# EAGLE design cmgresonator-en93-26 (EAGLE 6.6.0)
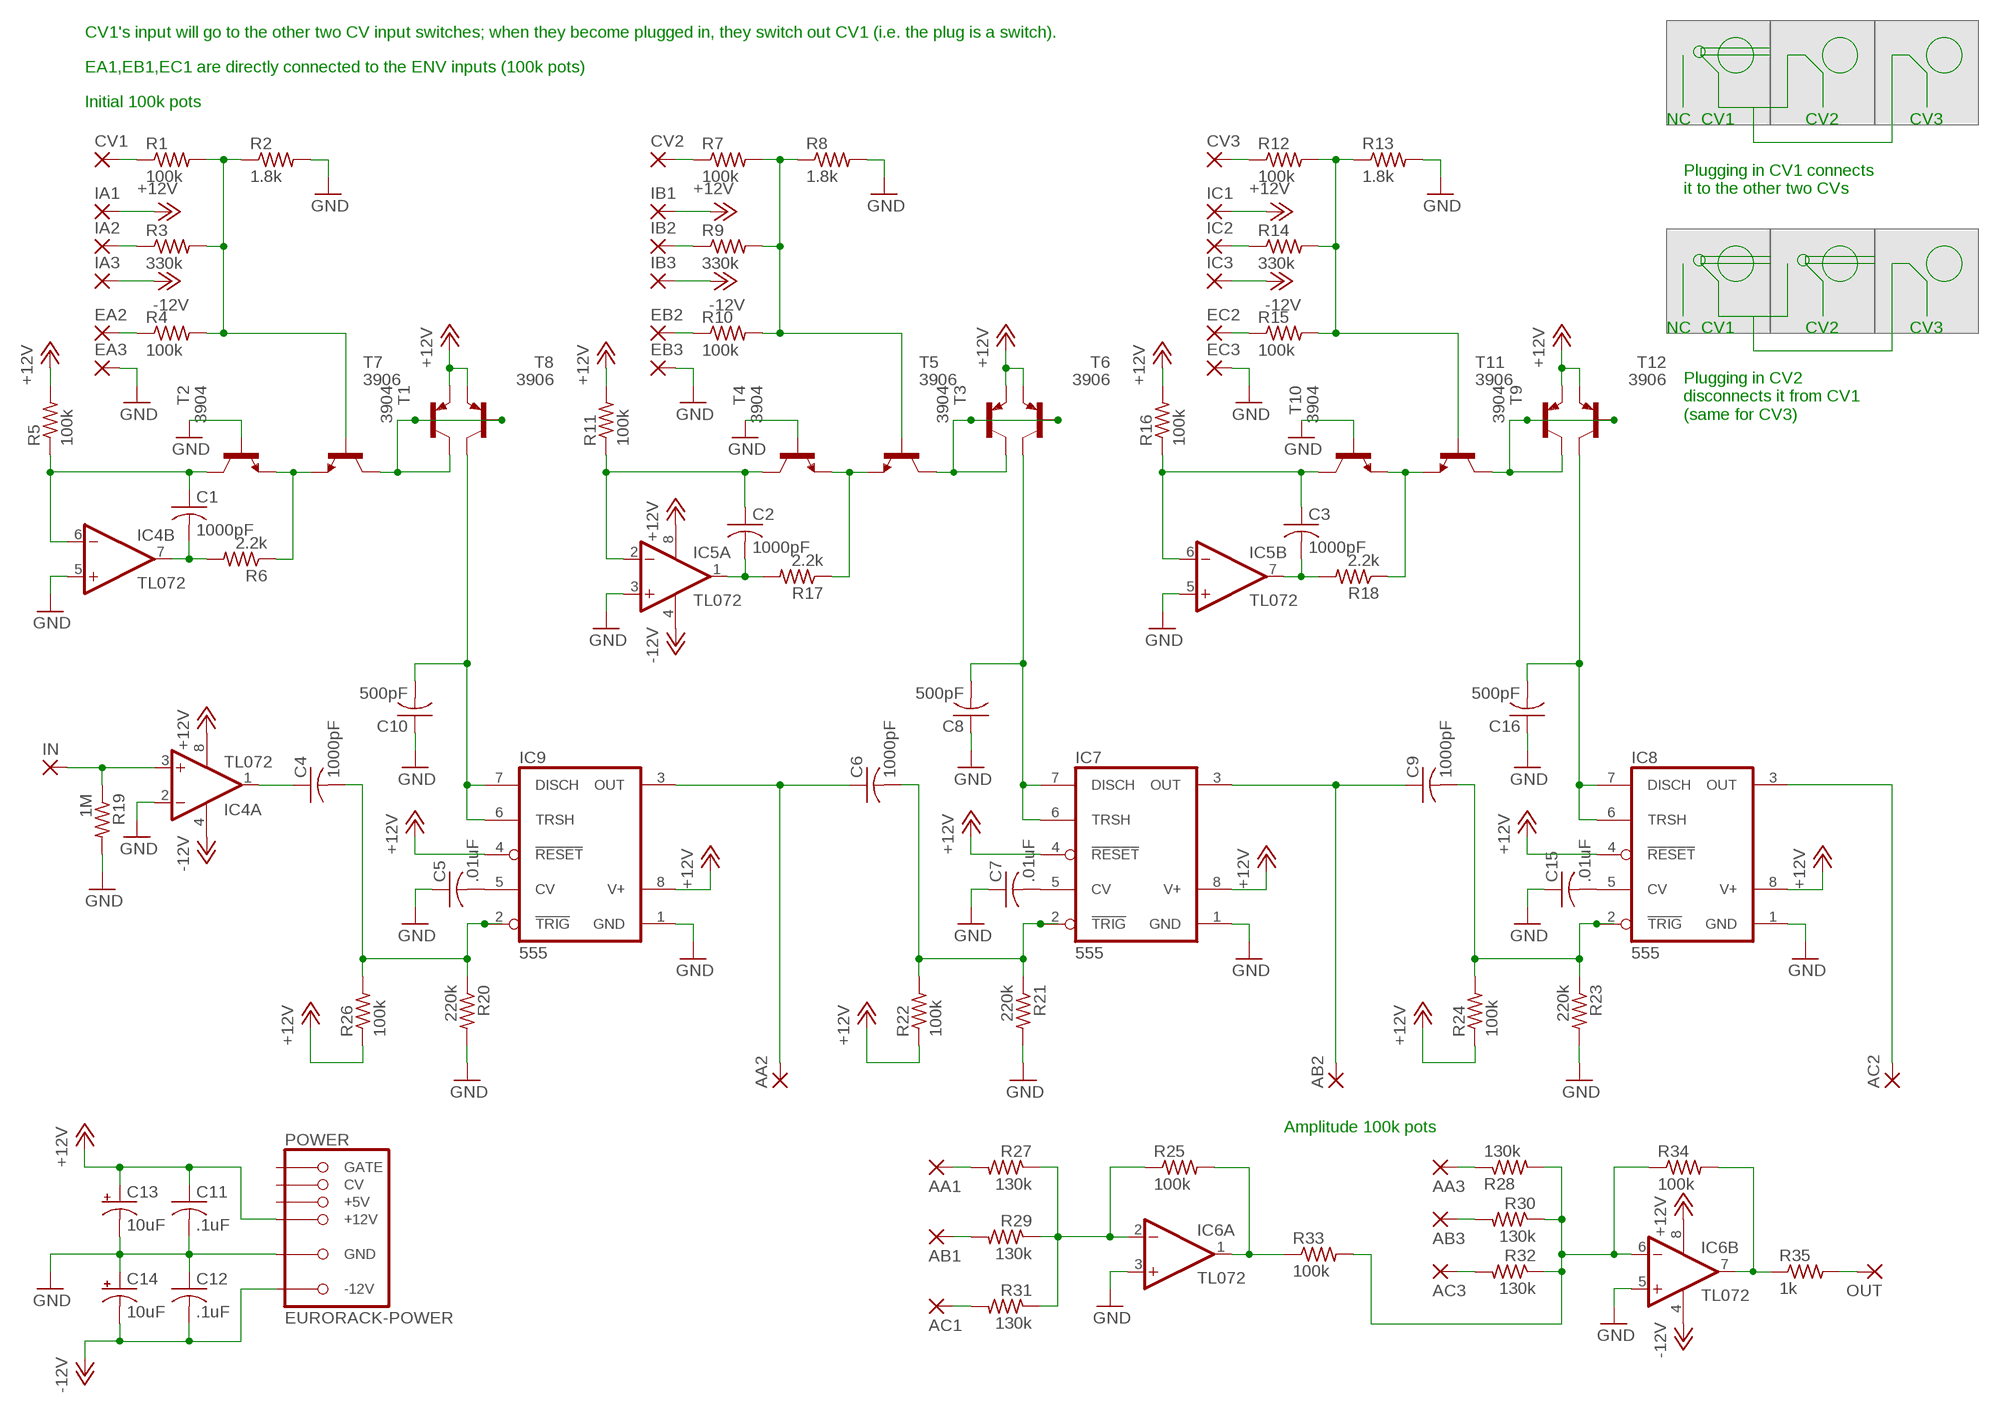
[diagram p0: schematic, sheet 1]

## Parts
AA1  2,54/1,0  [2,54/1,0]
AA2  2,54/1,0  [2,54/1,0]
AA3  2,54/1,0  [2,54/1,0]
AB1  2,54/1,0  [2,54/1,0]
AB2  2,54/1,0  [2,54/1,0]
AB3  2,54/1,0  [2,54/1,0]
AC1  2,54/1,0  [2,54/1,0]
AC2  2,54/1,0  [2,54/1,0]
AC3  2,54/1,0  [2,54/1,0]
C1  1000pF  C-US050-025X075  [C050-025X075]
C2  1000pF  C-US050-025X075  [C050-025X075]
C3  1000pF  C-US050-025X075  [C050-025X075]
C4  1000pF  C-US050-025X075  [C050-025X075]
C5  .01uF  C-US050-025X075  [C050-025X075]
C6  1000pF  C-US050-025X075  [C050-025X075]
C7  .01uF  C-US050-025X075  [C050-025X075]
C8  500pF  C-US050-025X075  [C050-025X075]
C9  1000pF  C-US050-025X075  [C050-025X075]
C10  500pF  C-US050-025X075  [C050-025X075]
C11  .1uF  C-US050-025X075  [C050-025X075]
C12  .1uF  C-US050-025X075  [C050-025X075]
C13  10uF  CPOL-USE2.5-5  [E2,5-5]
C14  10uF  CPOL-USE2.5-5  [E2,5-5]
C15  .01uF  C-US050-025X075  [C050-025X075]
C16  500pF  C-US050-025X075  [C050-025X075]
CV1  2,54/1,0  [2,54/1,0]
CV2  2,54/1,0  [2,54/1,0]
CV3  2,54/1,0  [2,54/1,0]
EA2  2,54/1,0  [2,54/1,0]
EA3  2,54/1,0  [2,54/1,0]
EB2  2,54/1,0  [2,54/1,0]
EB3  2,54/1,0  [2,54/1,0]
EC2  2,54/1,0  [2,54/1,0]
EC3  2,54/1,0  [2,54/1,0]
IA1  2,54/1,0  [2,54/1,0]
IA2  2,54/1,0  [2,54/1,0]
IA3  2,54/1,0  [2,54/1,0]
IB1  2,54/1,0  [2,54/1,0]
IB2  2,54/1,0  [2,54/1,0]
IB3  2,54/1,0  [2,54/1,0]
IC1  2,54/1,0  [2,54/1,0]
IC2  2,54/1,0  [2,54/1,0]
IC3  2,54/1,0  [2,54/1,0]
IC4  TL072  TL072-TOPP  [DIL08]
IC5  TL072  TL072-TOPP  [DIL08]
IC6  TL072  TL072-TOPP  [DIL08]
IC7  555  ICM7555  [DIL08]
IC8  555  ICM7555  [DIL08]
IC9  555  ICM7555  [DIL08]
IN  2,54/1,0  [2,54/1,0]
OUT  2,54/1,0  [2,54/1,0]
POWER  EURORACK-POWER  [PINSHRD_PTH_2X8]
R1  100k  R-US_0207/10  [0207/10]
R2  1.8k  R-US_0207/10  [0207/10]
R3  330k  R-US_0207/10  [0207/10]
R4  100k  R-US_0207/10  [0207/10]
R5  100k  R-US_0207/10  [0207/10]
R6  2.2k  R-US_0207/10  [0207/10]
R7  100k  R-US_0207/10  [0207/10]
R8  1.8k  R-US_0207/10  [0207/10]
R9  330k  R-US_0207/10  [0207/10]
R10  100k  R-US_0207/10  [0207/10]
R11  100k  R-US_0207/10  [0207/10]
R12  100k  R-US_0207/10  [0207/10]
R13  1.8k  R-US_0207/10  [0207/10]
R14  330k  R-US_0207/10  [0207/10]
R15  100k  R-US_0207/10  [0207/10]
R16  100k  R-US_0207/10  [0207/10]
R17  2.2k  R-US_0207/10  [0207/10]
R18  2.2k  R-US_0207/10  [0207/10]
R19  1M  R-US_0207/10  [0207/10]
R20  220k  R-US_0207/10  [0207/10]
R21  220k  R-US_0207/10  [0207/10]
R22  100k  R-US_0207/10  [0207/10]
R23  220k  R-US_0207/10  [0207/10]
R24  100k  R-US_0207/10  [0207/10]
R25  100k  R-US_0207/10  [0207/10]
R26  100k  R-US_0207/10  [0207/10]
R27  130k  R-US_0207/10  [0207/10]
R28  130k  R-US_0207/10  [0207/10]
R29  130k  R-US_0207/10  [0207/10]
R30  130k  R-US_0207/10  [0207/10]
R31  130k  R-US_0207/10  [0207/10]
R32  130k  R-US_0207/10  [0207/10]
R33  100k  R-US_0207/10  [0207/10]
R34  100k  R-US_0207/10  [0207/10]
R35  1k  R-US_0207/10  [0207/10]
T1  3904  2N3904-NPN-TO92-EBC  [TO92-EBC]
T2  3904  2N3904-NPN-TO92-EBC  [TO92-EBC]
T3  3904  2N3904-NPN-TO92-EBC  [TO92-EBC]
T4  3904  2N3904-NPN-TO92-EBC  [TO92-EBC]
T5  3906  2N3906-PNP-TO92-EBC  [TO92-EBC]
T6  3906  2N3906-PNP-TO92-EBC  [TO92-EBC]
T7  3906  2N3906-PNP-TO92-EBC  [TO92-EBC]
T8  3906  2N3906-PNP-TO92-EBC  [TO92-EBC]
T9  3904  2N3904-NPN-TO92-EBC  [TO92-EBC]
T10  3904  2N3904-NPN-TO92-EBC  [TO92-EBC]
T11  3906  2N3906-PNP-TO92-EBC  [TO92-EBC]
T12  3906  2N3906-PNP-TO92-EBC  [TO92-EBC]

## Nets
+12V: C11.1 C13.+ IA1.1(P) IB1.1(P) IC1.1(P) IC4.8(P:V+) IC5.8(P:V+) IC6.8(P:V+) IC7.4(RESET) IC7.8(V+) IC8.4(RESET) IC8.8(V+) IC9.4(RESET) IC9.8(V+) POWER.+12V@1(+12V) POWER.+12V@2(+12V) R5.2 R11.2 R16.2 R22.1 R24.1 R26.1 T5.E T6.E T7.E T8.E T11.E T12.E
-12V: C12.2 C14.- IA3.1(P) IB3.1(P) IC3.1(P) IC4.4(P:V-) IC5.4(P:V-) IC6.4(P:V-) POWER.-12V@1(-12V) POWER.-12V@2(-12V)
GND: C5.1 C7.1 C8.1 C10.1 C11.2 C12.1 C13.- C14.+ C15.1 C16.1 EA3.1(P) EB3.1(P) EC3.1(P) IC4.2(A:-IN) IC4.5(B:+IN) IC5.3(A:+IN) IC5.5(B:+IN) IC6.3(A:+IN) IC6.5(B:+IN) IC7.1(GND) IC8.1(GND) IC9.1(GND) POWER.GND@1(GND) POWER.GND@2(GND) POWER.GND@3(GND) POWER.GND@4(GND) POWER.GND@5(GND) POWER.GND@6(GND) R2.2 R8.2 R13.2 R19.2 R20.2 R21.2 R23.2 T2.B T4.B T10.B
N$1: R6.1 T1.E T2.E
N$2: R17.1 T3.E T4.E
N$4: C1.1 IC4.6(B:-IN) R5.1 T2.C
N$6: T1.C T7.B T7.C T8.B
N$7: CV1.1(P) R1.1
N$8: R1.2 R2.1 R3.2 R4.2 T1.B
N$9: IA2.1(P) R3.1
N$10: EA2.1(P) R4.1
N$11: C2.1 IC5.2(A:-IN) R11.1 T4.C
N$12: T3.C T5.B T5.C T6.B
N$13: CV2.1(P) R7.1
N$14: R7.2 R8.1 R9.2 R10.2 T3.B
N$15: IB2.1(P) R9.1
N$16: EB2.1(P) R10.1
N$17: R18.1 T9.E T10.E
N$19: C3.1 IC5.6(B:-IN) R16.1 T10.C
N$20: T9.C T11.B T11.C T12.B
N$21: CV3.1(P) R12.1
N$22: R12.2 R13.1 R14.2 R15.2 T9.B
N$23: IC2.1(P) R14.1
N$24: EC2.1(P) R15.1
N$25: C10.2 IC9.6(TRSH) IC9.7(DISCH) T8.C
N$26: C5.2 IC9.5(CV)
N$27: C8.2 IC7.6(TRSH) IC7.7(DISCH) T6.C
N$28: C4.2 IC9.2(TRIG) R20.1 R26.2
N$29: C7.2 IC7.5(CV)
N$30: C6.2 IC7.2(TRIG) R21.1 R22.2
N$31: C16.2 IC8.6(TRSH) IC8.7(DISCH) T12.C
N$32: C15.2 IC8.5(CV)
N$33: C9.2 IC8.2(TRIG) R23.1 R24.2
N$34: AA2.1(P) C6.1 IC9.3(OUT)
N$35: AB2.1(P) C9.1 IC7.3(OUT)
N$36: C4.1 IC4.1(A:OUT)
N$37: IC4.3(A:+IN) IN.1(P) R19.1
N$38: AA1.1(P) R27.2
N$39: AA3.1(P) R28.1
N$40: AC2.1(P) IC8.3(OUT)
N$41: AB1.1(P) R29.2
N$42: AC1.1(P) R31.2
N$43: AB3.1(P) R30.2
N$44: AC3.1(P) R32.2
N$45: IC6.6(B:-IN) R28.2 R30.1 R32.1 R33.2 R34.1
N$46: IC6.7(B:OUT) R34.2 R35.1
N$47: OUT.1(P) R35.2
N$48: IC6.1(A:OUT) R25.2 R33.1
N$49: C2.2 IC5.1(A:OUT) R17.2
N$57: IC6.2(A:-IN) R25.1 R27.1 R29.1 R31.1
N$58: C1.2 IC4.7(B:OUT) R6.2
N$59: C3.2 IC5.7(B:OUT) R18.2
Unconnected: POWER.+5V@1(+5V) POWER.+5V@2(+5V) POWER.CV@1(CV) POWER.CV@2(CV) POWER.GATE@1(GATE) POWER.GATE@2(GATE)

## Notes on the sheet
- CV1's input will go to the other two CV input switches; when they become plugged in, they switch out CV1 (i.e. the plug is a switch).
- EA1,EB1,EC1 are directly connected to the ENV inputs (100k pots)
- Initial 100k pots
- NC | CV1 | CV2 | CV3
- Plugging in CV1 connects
  it to the other two CVs
- NC | CV1 | CV2 | CV3
- Plugging in CV2
  disconnects it from CV1
  (same for CV3)
- Amplitude 100k pots

## Library data of the parts
AA1-AA3 AB1-AB3 AC1-AC3 CV1-CV3 EA2 EA3 EB2 EB3 EC2 EC3 IA1-IA3 IB1-IB3 IC1-IC3 IN OUT = wirepad:2,54/1,0: THROUGH-HOLE PAD
C1-C12 C15 C16 = rcl:C-US: CAPACITOR, American symbol
C13 C14 = rcl:CPOL-US: POLARIZED CAPACITOR, American symbol
IC4-IC6 = mmoretti:TL072-TOP: OP AMP
IC7-IC9 = maxim:ICM7555: TIMER; MF: MAXIM; MPN: ICM7555IPA+; OC_FARNELL: 9663762; OC_NEWARK: 68K4387
POWER = mmoretti:EURORACK-POWER
R1-R35 = rcl:R-US_: RESISTOR, American symbol
T1-T4 T9 T10 = transistor-neu-to92:*-NPN-: NPN Transistror
T5-T8 T11 T12 = transistor-neu-to92:*-PNP-: PNP Transistror

## Board
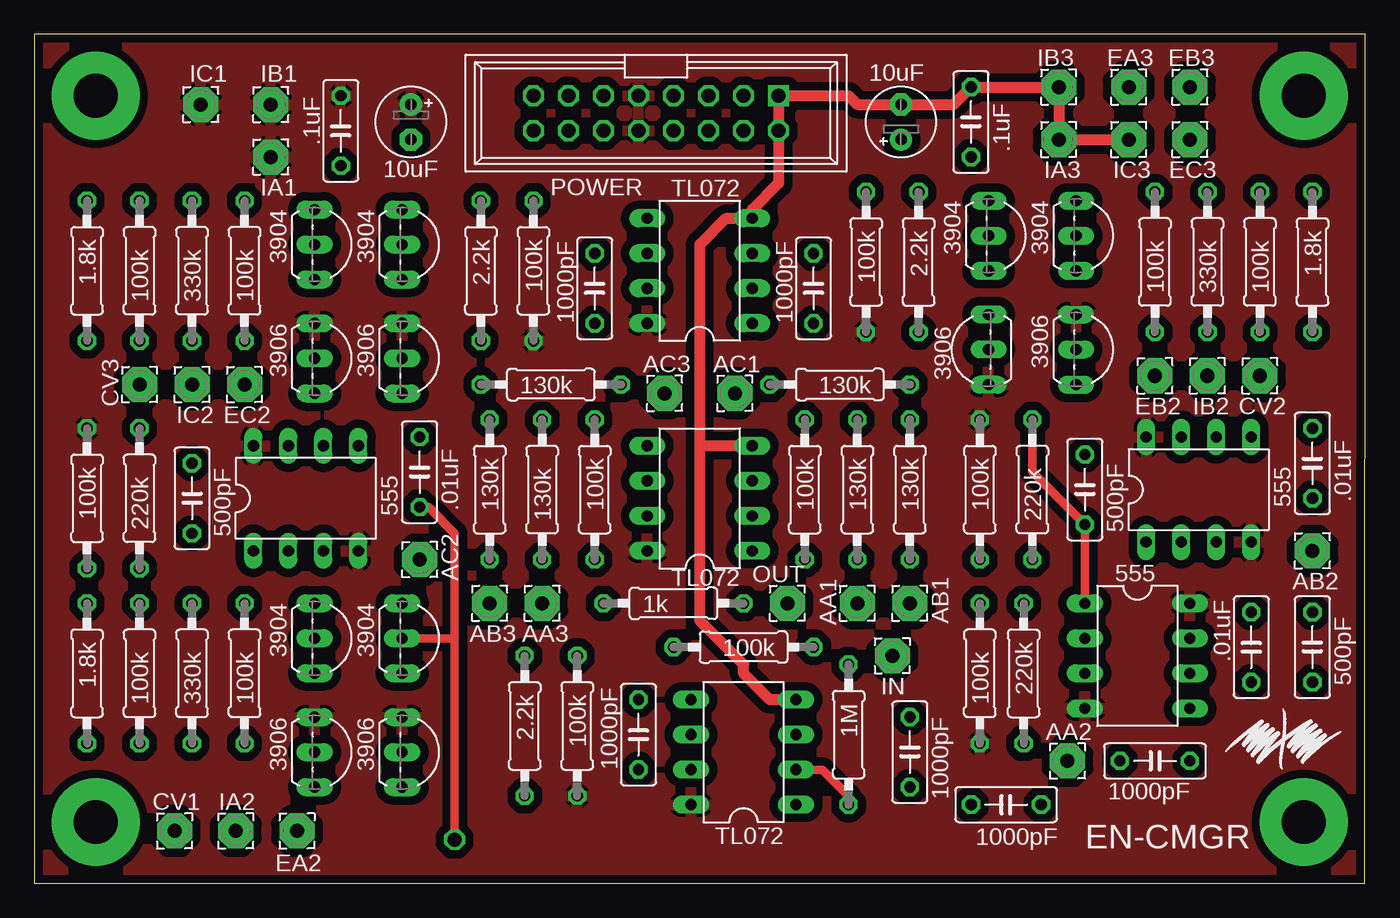
[diagram p1: board, top side]
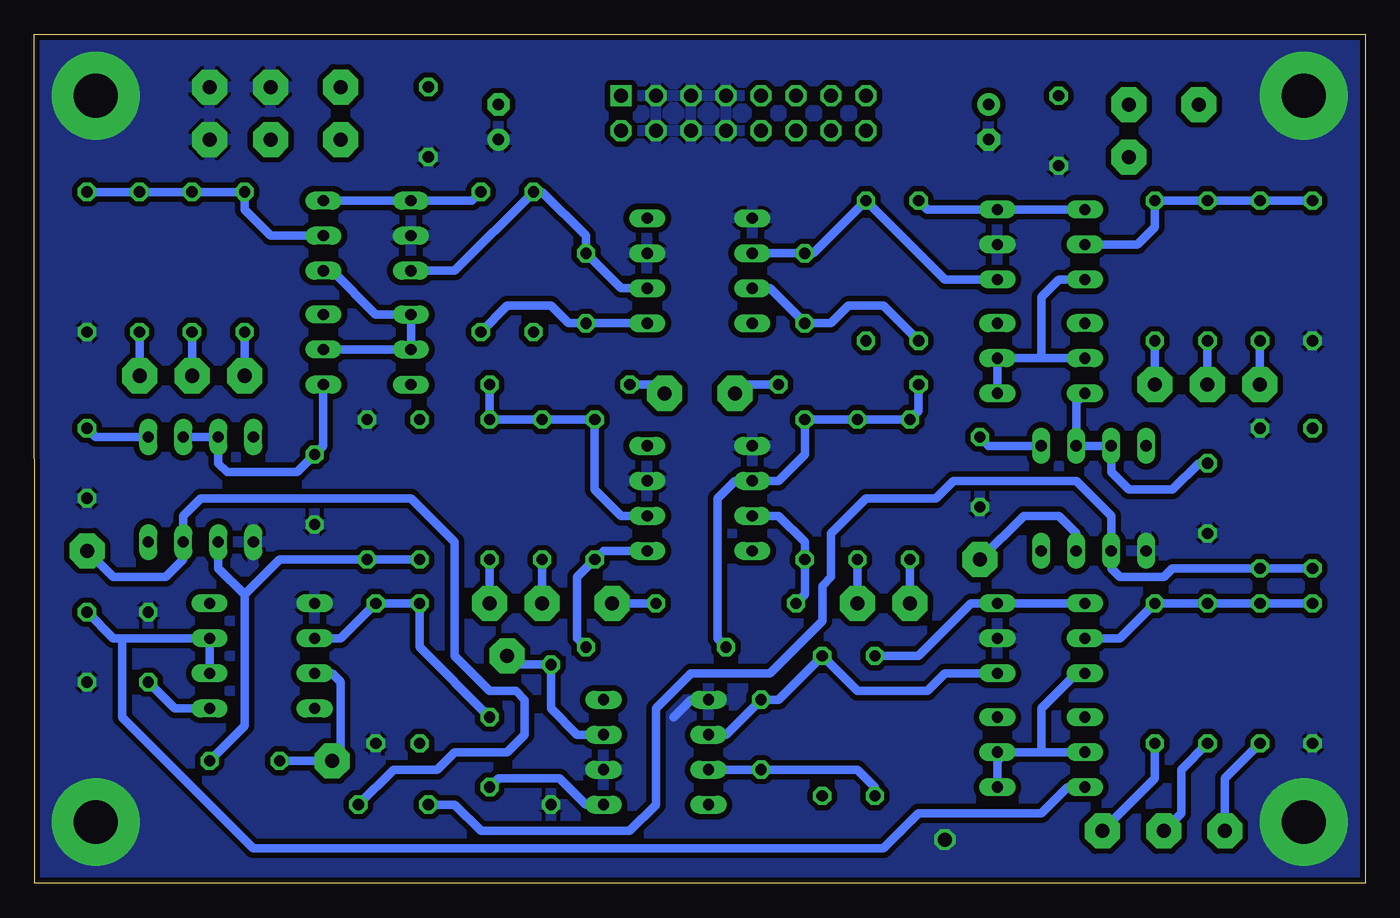
[diagram p2: board, bottom side, seen from below]

Size 96.52 x 61.59 mm. Coordinates in mm from the lower left corner, seen from the top.
Outline: 0,0 96.5,0 96.52,61.59 0,61.59 0,0
Copper layers (1*16): Top 0.035mm / dielectric 1.5mm / Bottom 0.035mm
Design rules "SeeedStudio_2layer_DRU_no_angle_20140221": minimum track width 6mil, minimum drill 12mil, track to track 6mil, track to pad 6mil, pad to pad 6mil, via to via 6mil, smd to smd 0mil, copper to edge 10mil, drill to drill 10mil, minimum pad ring 10mil, minimum via ring 6mil, stop-mask expansion 2mil, vias tented up to drill 100mil, thermal gap 10mil

### Footprints (pad centres in the part's own frame; a part is rotated, then mirrored left to right if it is on the bottom)
2,54/1,0 = drill 1.016 pad 2.54 octagon: 1 0,0
C050-025X075 = drill 0.813 octagon: 1 -2.54,0; 2 2.54,0
E2,5-5 = drill 0.813 pad 1.6: + -1.27,0 | drill 0.813 pad 1.6 octagon: - 1.27,0
DIL08 = drill 0.813 long: 1 -3.81,-3.81; 2 -1.27,-3.81; 3 1.27,-3.81; 4 3.81,-3.81; 5 3.81,3.81; 6 1.27,3.81; 7 -1.27,3.81; 8 -3.81,3.81
PINSHRD_PTH_2X8 = drill 1.016 octagon: +5V@1 3.81,1.27; +5V@2 3.81,-1.27; +12V@1 1.27,1.27; +12V@2 1.27,-1.27; -12V@1 -8.89,1.27; CV@1 6.35,1.27; CV@2 6.35,-1.27; GATE@1 8.89,1.27; GATE@2 8.89,-1.27; GND@1 -6.35,1.27; GND@2 -6.35,-1.27; GND@3 -3.81,1.27; GND@4 -3.81,-1.27; GND@5 -1.27,1.27; GND@6 -1.27,-1.27 | drill 1.016 square: -12V@2 -8.89,-1.27
0207/10 = drill 0.813 octagon: 1 -5.08,0; 2 5.08,0
TO92-EBC = drill 0.813 long: B 0,-1.27; C 2.54,-1.27; E -2.54,-1.27

### Placement (x,y rotation side)
AA1  59.69,20.32 90 top
AA2  74.93,8.89 270 top
AA3  36.83,20.32 90 top
AB1  63.5,20.32 90 top
AB2  92.71,24.13 90 top
AB3  33.02,20.32 90 top
AC1  50.8,35.56 90 top
AC2  27.94,23.5 90 top
AC3  45.72,35.56 90 top
C1  43.81,10.79 270 top
C2  56.52,43.18 270 top
C3  40.64,43.18 270 top
C4  63.5,9.53 90 top
C5  88.27,17.14 270 top
C6  81.28,8.89 0 top
C7  92.71,30.48 90 top
C8  76.2,28.57 90 top
C9  70.48,5.71 180 top
C10  92.71,17.14 90 top
C11  22.23,54.61 270 top
C12  67.94,55.24 90 top
C13  27.3,55.24 270 top
C14  62.87,55.24 90 top
C15  27.94,29.84 90 top
C16  11.43,27.94 90 top
CV1  10.16,3.81 270 top
CV2  88.9,36.83 90 top
CV3  7.62,36.2 90 top
EA2  19.05,3.81 270 top
EA3  79.38,57.78 90 top
EB2  81.28,36.83 90 top
EB3  83.82,57.78 90 top
EC2  15.24,36.2 90 top
EC3  83.82,53.98 90 top
IA1  17.14,52.7 90 top
IA2  14.61,3.81 270 top
IA3  74.3,53.98 90 top
IB1  17.14,56.52 90 top
IB2  85.09,36.83 90 top
IB3  74.3,57.78 90 top
IC1  12.06,56.52 90 top
IC2  11.43,36.2 90 top
IC3  79.38,53.98 90 top
IC4  51.44,9.53 90 top
IC5  48.26,44.45 90 top
IC6  48.26,27.94 90 top
IC7  84.45,28.57 0 top
IC8  19.68,27.94 0 top
IC9  80.01,16.51 270 top
IN  62.23,16.51 270 top
OUT  54.61,20.32 90 top
POWER  45.09,55.88 180 top
R1  7.62,15.24 90 top
R2  3.81,15.24 270 top
R3  11.43,15.24 90 top
R4  15.24,15.24 90 top
R5  39.37,11.43 270 top
R6  35.56,11.43 270 top
R7  88.9,45.09 90 top
R8  92.71,45.09 270 top
R9  85.09,45.09 90 top
R10  81.28,45.09 90 top
R11  60.33,45.09 270 top
R12  7.62,44.45 90 top
R13  3.81,44.45 270 top
R14  11.43,44.45 90 top
R15  15.24,44.45 90 top
R16  36.2,44.45 270 top
R17  64.14,45.09 270 top
R18  32.38,44.45 270 top
R19  59.05,10.79 270 top
R20  71.75,15.24 270 top
R21  72.39,28.57 90 top
R22  68.58,28.57 270 top
R23  7.62,27.94 90 top
R24  3.81,27.94 270 top
R25  55.88,28.57 270 top
R26  68.58,15.24 90 top
R27  59.69,28.57 270 top
R28  36.83,28.57 90 top
R29  63.5,28.57 270 top
R30  33.02,28.57 270 top
R31  58.42,36.2 180 top
R32  37.47,36.2 0 top
R33  51.44,17.14 180 top
R34  40.64,28.57 270 top
R35  46.35,20.32 0 top
T1  21.59,17.78 270 top
T2  27.94,17.78 270 top
T3  76.83,46.99 270 top
T4  70.48,46.99 270 top
T5  67.94,38.73 90 top
T6  76.83,38.73 270 top
T7  27.94,9.53 270 top
T8  21.59,9.53 270 top
T9  21.59,46.35 270 top
T10  27.94,46.35 270 top
T11  27.94,38.1 270 top
T12  21.59,38.1 270 top

### Tracks (layer width: path | path; a pad name or v marks a point on that pad's centre or on a via)
+12V
  pour Top (isolate 0.61): 0,61.59 0,0 96.52,0 96.52,61.59
-12V
  Top 0.813: IC3.1 IA3.1 IB3.1 C12.2 66.67,56.52 C14.- 59.69,56.52 59.05,57.15 POWER.-12V@2 POWER.-12V@1 53.98,50.8 52.07,48.9 IC5.4 50.16,48.26 48.26,46.35 48.26,31.75 | IC4.4 53.34,13.34 51.44,15.24 51.44,15.88 48.26,19.05 48.26,31.75 | IC6.4 48.26,31.75
GND  (via drill 1, 3.17 pad 6.35)
  Top 0.61: T2.B 30.48,17.78 | 30.48,17.78 30.48,25.4 28.57,27.3 C15.1 | 30.48,17.78 v30.48,3.17 | R19.2 59.05,6.35 57.15,8.26 IC4.2 | R21.2 72.39,29.84 C8.1 IC9.1
  Bottom 0.61: IC4.5 48.9,13.34 50.16,12.06
  other vias: 4.45,57.15 92.08,57.15 4.45,4.45 92.08,4.45
  pour Bottom (isolate 0.406): 0,61.59 96.52,61.59 96.52,0 0,0
N$1
  Bottom 0.61: T1.E T2.E 28.57,20.32 32.38,16.51 R6.1
N$2
  Bottom 0.61: T3.E T4.E 64.77,49.53 R17.1
N$4
  Bottom 0.61: T2.C 30.48,15.24 31.75,13.97 36.83,13.97 R5.1 42.55,13.34 C1.1 46.35,10.79 IC4.6
N$6
  Bottom 0.61: T8.B 23.5,9.53 | 23.5,9.53 26.04,9.53 | 26.04,9.53 T7.B | T1.C 20.95,15.24 23.5,12.7 23.5,9.53 | T7.C 26.67,8.89 26.04,9.53
N$7
  Bottom 0.61: R1.1 10.16,7.62 CV1.1
N$8
  Bottom 0.61: R2.1 R1.2 R3.2 R4.2 17.78,17.78 T1.B
N$9
  Bottom 0.61: R3.1 13.34,8.26 13.34,5.08 IA2.1
N$10
  Bottom 0.61: R4.1 15.24,7.62 EA2.1
N$11
  Bottom 0.61: IC5.2 53.98,43.18 C2.1 56.52,46.99 59.69,50.16 R11.1 66.04,44.45 T4.C
N$12
  Bottom 0.61: T6.B T5.B T5.C 71.75,41.27 74.93,44.45 T3.C
N$13
  Bottom 0.61: R7.1 CV2.1
N$14
  Bottom 0.61: T3.B 79.38,46.99 81.28,48.9 R10.2 R9.2 R7.2 R8.1
N$15
  Bottom 0.61: R9.1 IB2.1
N$16
  Bottom 0.61: R10.1 EB2.1
N$17
  Bottom 0.61: T9.E T10.E 31.75,48.9 R18.1
N$19
  Bottom 0.61: T10.C 30.48,43.81 R16.1 40.01,45.72 C3.1 IC5.6
N$20
  Bottom 0.61: T12.B 23.5,38.1 | 23.5,38.1 T11.B T11.C | T9.C 22.23,43.81 23.5,42.55 23.5,38.1
N$21
  Bottom 0.61: R12.1 CV3.1
N$22
  Bottom 0.61: R13.1 R12.2 R14.2 R15.2 15.24,47.62 16.51,46.35 T9.B
N$23
  Bottom 0.61: R14.1 IC2.1
N$24
  Bottom 0.61: R15.1 EC2.1
N$25
  Bottom 0.61: T8.C 21.59,6.99 23.5,5.08 32.38,5.08 34.92,2.54 80.64,2.54 90.17,12.06 90.17,17.78 | IC9.6 IC9.7 90.17,17.78 | 90.17,17.78 90.81,17.78 C10.2
N$26
  Bottom 0.61: IC9.5 86.36,12.7 C5.2
N$27
  Bottom 0.61: IC7.6 IC7.7 83.19,30.48 82.55,29.84 77.47,29.84 C8.2 75.56,31.75 T6.C
N$28
  Bottom 0.61: C4.2 68.58,17.14 R26.2 R20.1 74.3,17.78 IC9.2
N$29
  Bottom 0.61: IC7.5 92.08,32.38 C7.2
N$30
  Bottom 0.61: C6.2 81.28,11.43 81.28,20.95 | 81.28,20.95 83.19,22.86 IC7.2 | R22.2 R21.1 78.74,23.5 81.28,20.95
N$31
  Bottom 0.61: C16.2 12.06,30.48 13.97,28.57 17.14,28.57 18.41,29.84 IC8.7 IC8.6 20.95,34.92 T12.C
N$32
  Bottom 0.61: IC8.5 27.3,31.75 C15.2
N$33
  Bottom 0.61: R24.2 R23.1 13.97,22.86 14.61,22.23 17.78,22.23 18.41,22.86 IC8.2 18.41,26.67 20.95,29.21 29.84,29.21 31.11,27.94 36.2,27.94 38.73,25.4 38.73,22.23 39.37,21.59 39.37,19.05 43.18,15.24 48.9,15.24 51.44,12.7 51.44,5.71 53.34,3.81 64.14,3.81 66.04,5.71 C9.2
N$34
  Bottom 0.61: IC9.3 74.93,15.24 74.3,14.61 74.3,9.53 AA2.1 C6.1
N$35
  Bottom 0.61: AB2.1 90.81,22.23 87,22.23 85.72,23.5 IC7.3 85.72,26.67 84.45,27.94 69.22,27.94 66.04,24.77 66.04,16.51 63.5,13.97 61.59,13.97 60.96,13.34 60.96,10.79 62.23,9.53 66.04,9.53 67.31,8.26 70.48,8.26 C9.1
N$36
  Bottom 0.61: IC4.1 56.52,5.71 58.42,7.62 62.87,7.62 C4.1
N$37
  Bottom 0.61: IC4.3 57.15,10.79 59.05,12.7 R19.1 61.59,15.88 IN.1
N$38
  Bottom 0.61: R27.2 AA1.1
N$39
  Bottom 0.61: AA3.1 R28.1
N$40
  Bottom 0.61: IC8.3 20.95,25.4 22.23,26.67 24.77,26.67 AC2.1
N$41
  Bottom 0.61: R29.2 AB1.1
N$42
  Bottom 0.61: R31.2 51.44,36.2 AC1.1
N$43
  Bottom 0.61: AB3.1 R30.2
N$44
  Bottom 0.61: R32.2 45.09,36.2 AC3.1
N$45
  Bottom 0.61: R33.2 46.99,17.78 46.99,27.94 45.72,29.21 IC6.6 42.55,29.21 40.64,31.11 R34.1 R28.2 R30.1 32.38,34.29 R32.1
N$46
  Bottom 0.61: IC6.7 42.55,26.67 40.64,24.77 R34.2 40.64,20.95 R35.1
N$47
  Bottom 0.61: R35.2 OUT.1
N$48
  Bottom 0.61: R33.1 57.15,17.78 57.15,22.23 R25.2 55.24,24.13 IC6.1
N$49
  Bottom 0.61: IC5.1 C2.2 57.78,40.64 59.05,41.91 62.23,41.91 R17.2
N$57
  Bottom 0.61: IC6.2 53.98,26.67 55.88,28.57 R25.1 R27.1 R29.1 R31.1
N$58
  Bottom 0.61: IC4.7 C1.2 36.83,8.26 35.56,6.99 R6.2
N$59
  Bottom 0.61: IC5.7 43.18,43.18 C3.2 38.73,40.64 37.47,41.91 34.92,41.91 R18.2

### Text on the board
tPlace: EN-CMGR